# Altium schematic sheet Inverter.SchDoc (part 3 of 3)
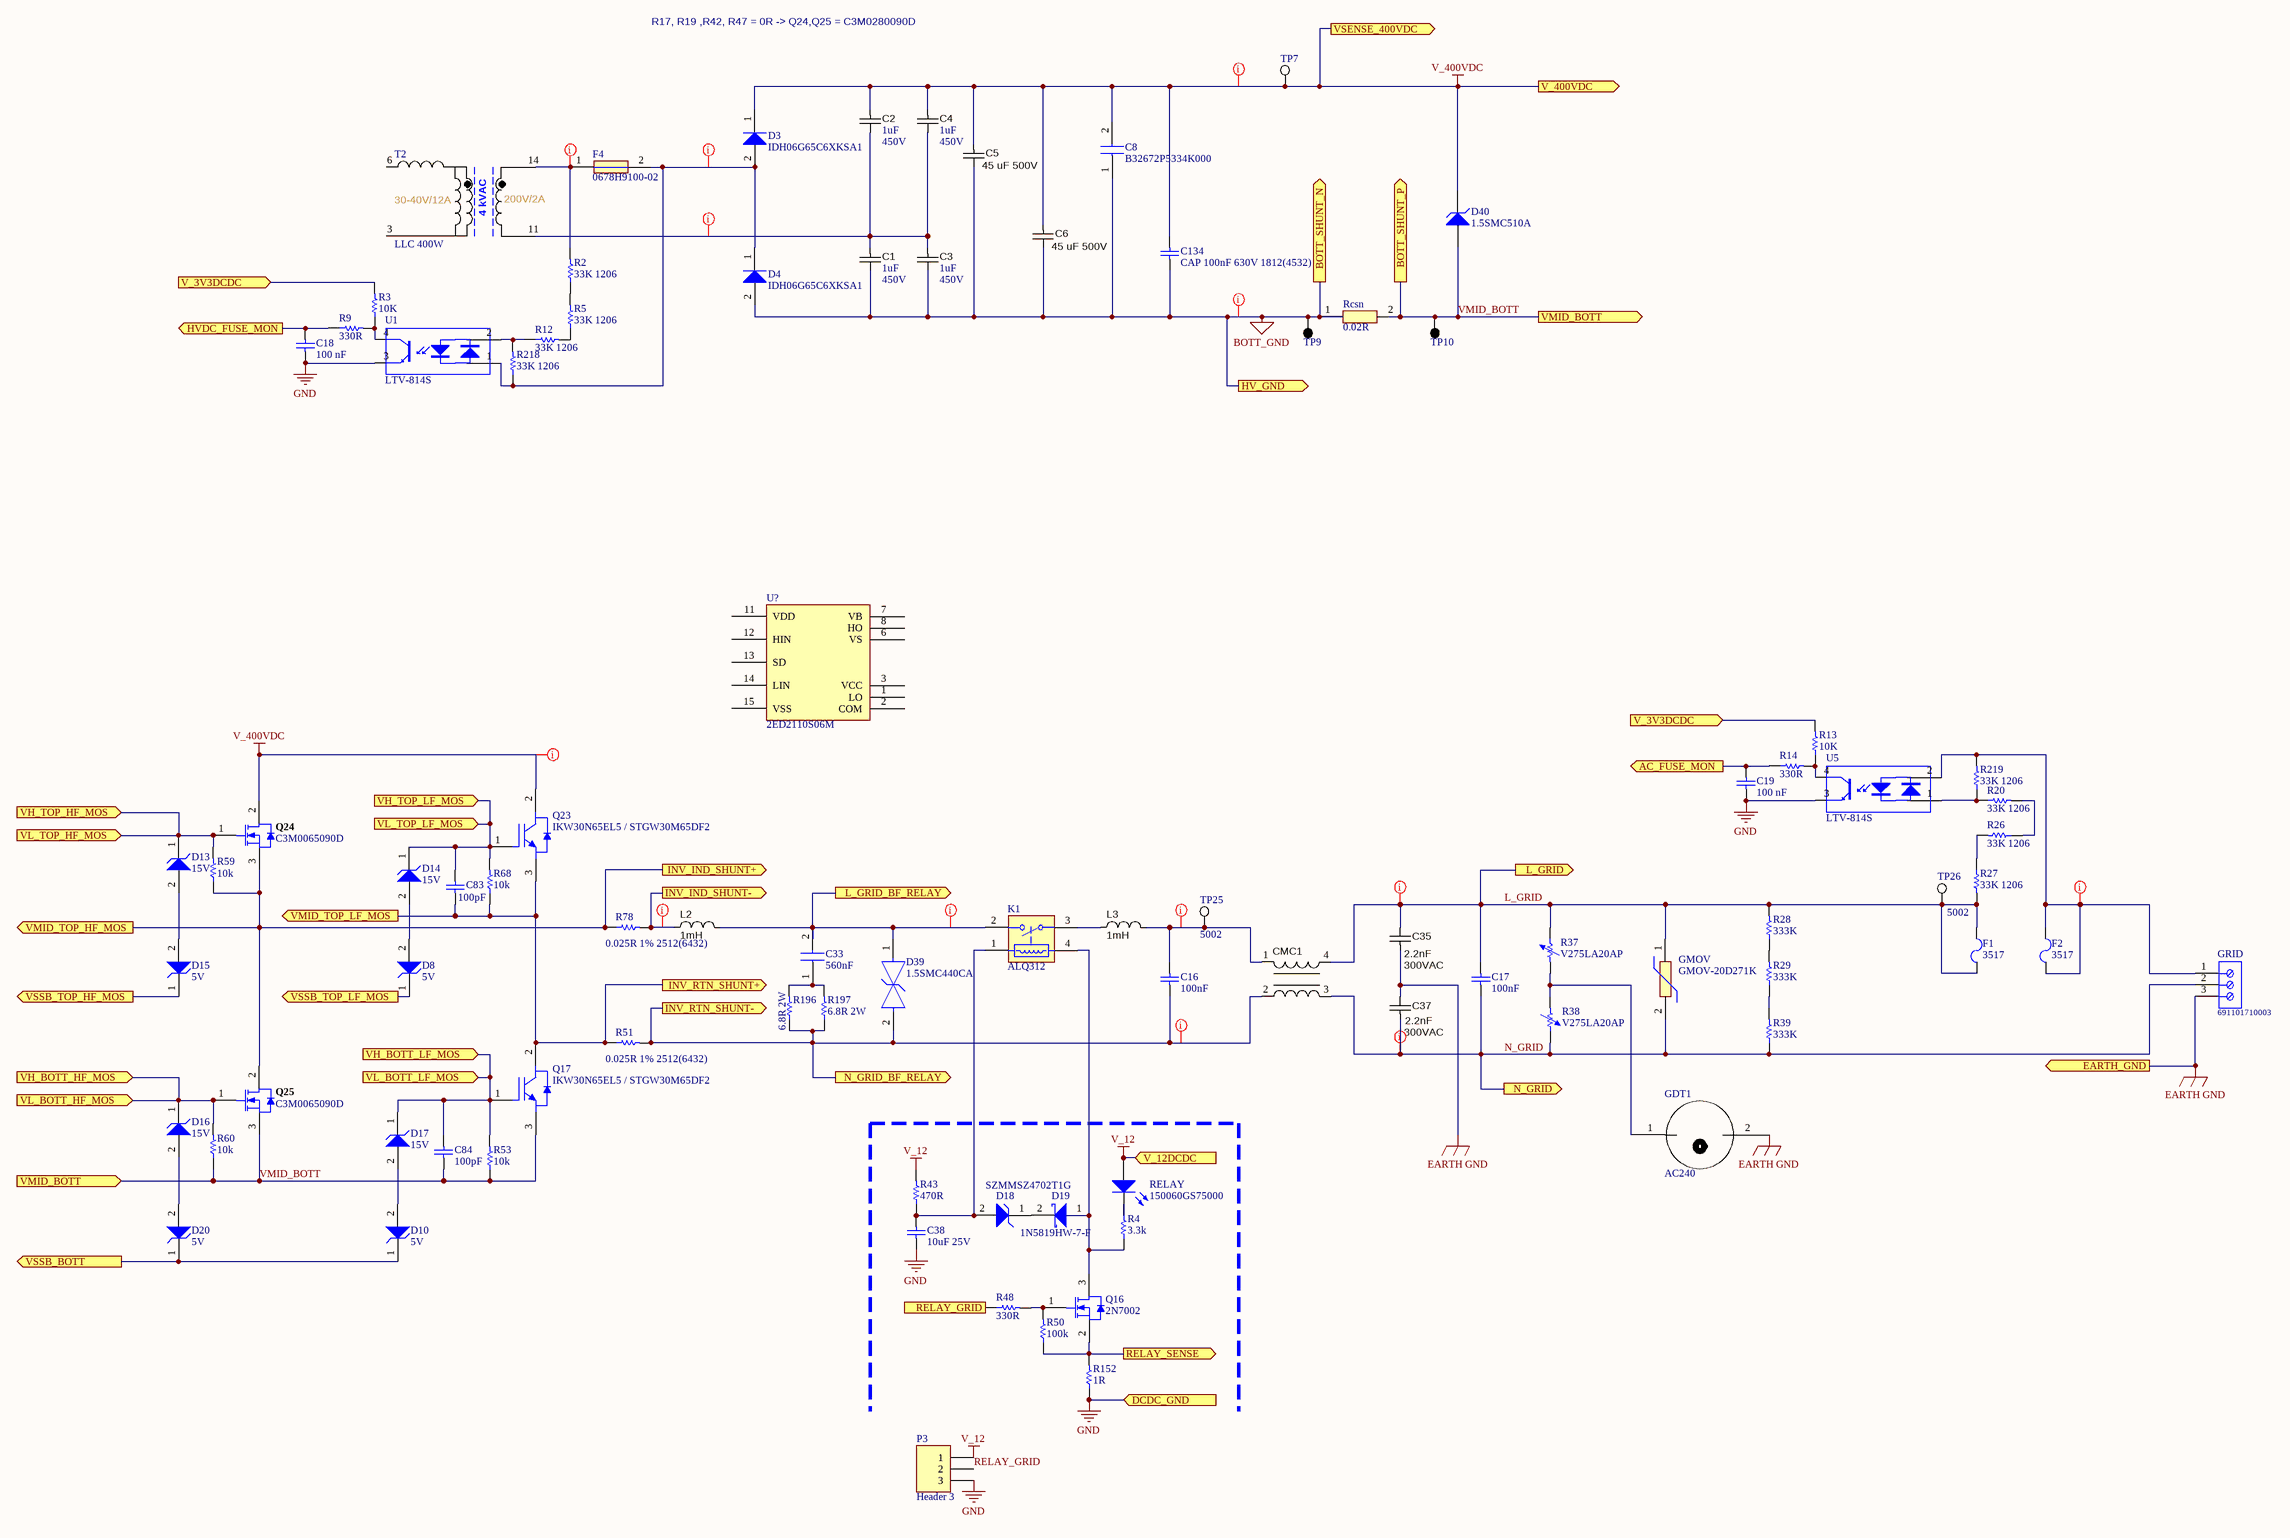
[diagram p2: Inverter.SchDoc]

## Library data of the parts (continued)
R152 = CMP-2000-00841-1: Part Number: ERJ-3RQF1R0V; Manufacturer: Panasonic; Tolerance: 1%; Temperature Coefficient: 200ppm/°C; Power Rating: 100mW; Supplier 1: Digi-Key; Supplier Part Number 1: P1.0AJCT-ND; Manufacturer Part Number: ERJ-3RQF1R0V; RoHS: Yes; Category: Chip SMD Resistors; Stock 1: 180732; Pricing 1: 1=0.16000, 10=0.13600, 25=0.09920, 50=0.07200, 100=0.05330, 250=0.04092, 500=0.03224, 1000=0.02232 (USD); Mount: Surface Mount; Case/Package: 0603; Number of Pins: 2; Case Code (Imperial): 0603; Case Code (Metric): 1608; Contact Plating: Tin; Weight: 7.1E-05oz; Size Code: 0603; Min Operating Temperature: -55°C; Max Operating Temperature: 125°C; Packaging: Tape and Reel; Resistance: 1R; Series: ERJ; Resistor Type: Thick Film; Package Quantity: 5000; Termination: SMD/SMT; Number of Terminations: 2; Max Power Dissipation: 100mW; Construction: Rectangular; Resistance Tolerance: 1%; Technology: THICK FILM; Length: 1.6mm; Width: 0.8mm; Height: 0.45mm; Depth: 0.8mm; Radiation Hardening: No; RoHS Compliant: Yes; Lead Free: Lead Free; REACH SVHC: No SVHC; Military Standard: Not; ComponentLink1URL: https://datasheet.ciiva.com/11810/0900766b80eefa12-11810728.pdf?src-supplier=RSComponents; ComponentLink1Description: https://datasheet.ciiva.com/11810/0900766b80eefa12-11810728.pdf?src-supplier=RSComponents; ComponentLink2URL: https://datasheet.ciiva.com/16396/aoa0000ce3-16396837.pdf?src-supplier=Future+Electronics; ComponentLink2Description: https://datasheet.ciiva.com/16396/aoa0000ce3-16396837.pdf?src-supplier=Future+Electronics; ComponentLink3URL: https://datasheet.ciiva.com/28691/391509-28691973.pdf?src-supplier=Element14; ComponentLink3Description: https://datasheet.ciiva.com/28691/391509-28691973.pdf?src-supplier=Element14; ComponentLink4URL: https://datasheet.ciiva.com/16784/70068852-16784839.pdf?src-supplier=Allied+Electronics; ComponentLink4Description: https://datasheet.ciiva.com/16784/70068852-16784839.pdf?src-supplier=Allied+Electronics; ComponentLink5URL: https://datasheet.ciiva.com/9117/aoa0000ce3-9117368.pdf?src-supplier=Avnet; ComponentLink5Description: https://datasheet.ciiva.com/9117/aoa0000ce3-9117368.pdf?src-supplier=Avnet; ComponentLink6URL: https://datasheet.ciiva.com/24165/aoa0000ce3-72189-24165336.pdf?src-supplier=Mouser; ComponentLink6Description: https://datasheet.ciiva.com/24165/aoa0000ce3-72189-24165336.pdf?src-supplier=Mouser; ComponentLink7URL: https://datasheet.ciiva.com/30060/6aoa0000ce3-30060648.pdf?src-supplier=Onlinecomponents.com; ComponentLink7Description: https://datasheet.ciiva.com/30060/6aoa0000ce3-30060648.pdf?src-supplier=Onlinecomponents.com; ComponentLink8URL: https://datasheet.ciiva.com/6138/391509-6138777.pdf?src-supplier=Farnell; ComponentLink8Description: https://datasheet.ciiva.com/6138/391509-6138777.pdf?src-supplier=Farnell; ComponentLink9URL: https://datasheet.ciiva.com/16766/70068852-16766778.pdf?src-supplier=Allied+Electronics; ComponentLink9Description: https://datasheet.ciiva.com/16766/70068852-16766778.pdf?src-supplier=Allied+Electronics; ComponentLink10URL: https://datasheet.ciiva.com/16853/aoa0000ce3-16853436.pdf?src-supplier=Avnet+Europe; ComponentLink10Description: https://datasheet.ciiva.com/16853/aoa0000ce3-16853436.pdf?src-supplier=Avnet+Europe; ComponentLink11URL: https://datasheet.ciiva.com/43455/391509-43455868.pdf?src-supplier=Farnell; ComponentLink11Description: https://datasheet.ciiva.com/43455/391509-43455868.pdf?src-supplier=Farnell; ComponentLink12URL: https://datasheet.ciiva.com/28547/391509-28547230.pdf?src-supplier=Element14; ComponentLink12Description: https://datasheet.ciiva.com/28547/391509-28547230.pdf?src-supplier=Element14
R196 R197 = CMP-1018-00284-1: 10R 1W 1% 2512 (6432 Metric)  SMD; Case-EIA: 2512; Value: 10.00 Ohm; Case-Metric: 6432; Power: 1 W; Technology: SMT; Tolerance: 1 %
Rcsn = FCSL32R010FER: Resistors FCSL Series Metal Foil Power Rating 1.5W Tape Reel Resistance 20 mOhms; Manufacturer_Name: Ohmite; Manufacturer_Part_Number: FCSL32R020FER; Datasheet Link: https://www.mouser.com/datasheet/2/303/res_fcsl-1265567.pdf; Height: 0.8mm; Mouser Part Number: 588-FCSL32R020FER; Mouser Price/Stock: https://www.mouser.co.uk/ProductDetail/Ohmite/FCSL32R010FER?qs=y6ZabgHbY%252Bzyqz46BACxrg%3D%3D; Supplier 1: Digi-Key; Supplier Part Number 1: FCSL32R020FERCT-ND; Manufacturer: Ohmite; Manufacturer Part Number: FCSL32R020FER; RoHS: Yes; Category: Chip SMD Resistors; Stock 1: 1940; Pricing 1: 1=0.63000, 10=0.45000, 25=0.35120, 50=0.29700, 100=0.23400, 250=0.19800, 500=0.16200, 1000=0.12600 (USD); ComponentLink1URL: http://www.farnell.com/datasheets/2645666.pdf?src-supplier=Farnell; ComponentLink1Description: http://www.farnell.com/datasheets/2645666.pdf?src-supplier=Farnell
RELAY = CMP-1426-00002-1: SMD mono-color Chip LED, WL-SMCW, Green; Manufacturer: Wuerth Elektronik; ComponentLink1URL: http://www.we-online.com; ComponentLink2Description: Datasheet; Color: Green; ComponentLink2URL: http://katalog.we-online.com/led/datasheet/150060GS75000.pdf; PartNumber: 150060GS75000; PackageReference: 0603_A; ComponentLink1Description: Manufacturer URL
T2 = TI-ETD39-200V-2A-LLC: Lr=1.9uH / Lm=10.2uH / n=5.7 / Vin=30-40V / Vout=200V
TP7 TP25 TP26 = CMP-2000-05182-1: Test Point, White, 1-Pin THD, RoHS, Bulk; Manufacturer: KeystoneElectronics; Outside Diameter: 2.54mm; Plating: Silver; Mounting Hole Size: 1mm; Product: TestPoints; Packaging: Bulk; Manufacturer URL: http://www.keyelco.com/; Length: 7.62mm; Datasheet Version: Rev. G, 12/2008; Type: Miniature; Product Category: CircuitBoardHardware-PCB; Material: Nylon; RoHS: True; Contact Material: PhosphorBronze; Datasheet URL: https://ciiva.com/datasheet-click-2917627?src=ciiva&sig=bd195616; Color: White; Brand: KeystoneElectronics
TP9 TP10 = CMP-2000-05181-1: Test Point, Black, 1-Pin THD, RoHS, Bulk; Manufacturer: Keystone; Other Names: 5001K; Catalog Drawings: 5000Series; Alternate Color: 5004K-ND / -TESTPOINTPCMINI.040"DYELLOW / 5003K-ND / -TESTPOINTPCMINI.040"DORANGE / 5002K-ND / -TESTPOINTPCMINI.040"DWHITE / 5000K-ND / -TESTPOINTPCMINI.040"DRED; Kits: DKTGRS232C-KIT-ND / -TTLCONVERTER; Online Catalog: ColorCodedTestPoints; Datasheet URL: https://ciiva.com/datasheet-click-2917627?src=ciiva&sig=bd195616; Mounting Type: 0.040"(1.02mm)HoleDiameter; Family: TestPoints; RoHS Information: RoHSComplianceStatement; Datasheet Version: Rev. G, 12/2008; Color: Black; Category: TestandMeasurement; Standard Package: 100; Manufacturer URL: http://www.keyelco.com/; Material: Base,Nylon46,UL94V-0; Type: PCTestPoint,Miniature; Terminal: 0.010"x0.020"(0.25mmx0.51mm)PhosphorBronzeWire,SilverPlated; Series: THM; Packaging: Bulk
U1 U5 = LTV-814S: Optocoupler DC-IN 1-CH Transistor DC-OUT 4-Pin PDIP SMD T/R; Manufacturer: Vishay Lite-On; Manufacturer Part Number: LTV-816S-TA1; Number of Channels: 1; Max Output Voltage: 80V; Forward Voltage: 1.4V; Output Current per Channel: 50mA; Collector-emitter Voltage-Max: 200mV; Rise Time: 18000ns; Input Type: DC; Max Power Dissipation: 200mW; Current Transfer Ratio: 320%; Isolation Voltage: 5kV; Reverse Breakdown Voltage: 6V; Supplier 1: Mouser; RoHS: Yes; Category: Optocouplers; Stock 1: 373; Pricing 1: 1=0.22000, 10=0.19900, 50=0.19900, 100=0.18000, 1000=0.12500, 10000=0.09700 (USD); Mount: Surface Mount; Case/Package: SMD/SMT; Number of Pins: 4; Min Operating Temperature: -50°C; Max Operating Temperature: 110°C; Packaging: Tape and Reel; Collector Emitter Voltage (VCEO): 80V; Series: -; Output Voltage: 80V; Number of Circuits: 1; Forward Current: 50mA; Package Quantity: 1000; Collector Emitter Saturation Voltage: 200mV; Max Collector Current: 50mA; Number of Elements: 1; Power Dissipation: 200mW; Max Input Current: 50mA; Fall Time: 18000ns; Isolation Voltage-Max: 5kV; Radiation Hardening: No; RoHS Compliant: Yes; Lead Free: Lead Free; ComponentLink1URL: https://datasheet.ciiva.com/15119/getdatasheetpartid-317372-15119066.pdf?src-supplier=Verical; ComponentLink1Description: https://datasheet.ciiva.com/15119/getdatasheetpartid-317372-15119066.pdf?src-supplier=Verical; ComponentLink2URL: https://datasheet.ciiva.com/6573/s-110-ltv-816826846m-s-s-ta-s-ta1-s-tpseries-6573991.pdf?src-supplier=Digi-Key; ComponentLink2Description: https://datasheet.ciiva.com/6573/s-110-ltv-816826846m-s-s-ta-s-ta1-s-tpseries-6573991.pdf?src-supplier=Digi-Key; ComponentLink3URL: https://datasheet.ciiva.com/6573/s-110-ltv-816826846m-s-s-ta-s-ta1-s-tpseries-6573992.pdf?src-supplier=Digi-Key; ComponentLink3Description: https://datasheet.ciiva.com/6573/s-110-ltv-816826846m-s-s-ta-s-ta1-s-tpseries-6573992.pdf?src-supplier=Digi-Key; ComponentLink4URL: https://datasheet.ciiva.com/6573/s-110-ltv-816826846m-s-s-ta-s-ta1-s-tpseries-6573993.pdf?src-supplier=Digi-Key; ComponentLink4Description: https://datasheet.ciiva.com/6573/s-110-ltv-816826846m-s-s-ta-s-ta1-s-tpseries-6573993.pdf?src-supplier=Digi-Key; Supplier Part Number 1: 859-LTV-816S-TA1
U? = 2ED2110S06M: 650 V high-side and low-side gate driver with integrated bootstrap diode; Manufacturer: Infineon; Manufacturer Part Number: 2ED2110S06MXUMA1; Supplier 1: Digi-Key; RoHS: Yes; Pricing 1: 1000=4.53414 (USD); Supplier Part Number 1: 2220Y1000471FCT-ND